# EAGLE design RotaryEncoder (EAGLE 7.1.0)
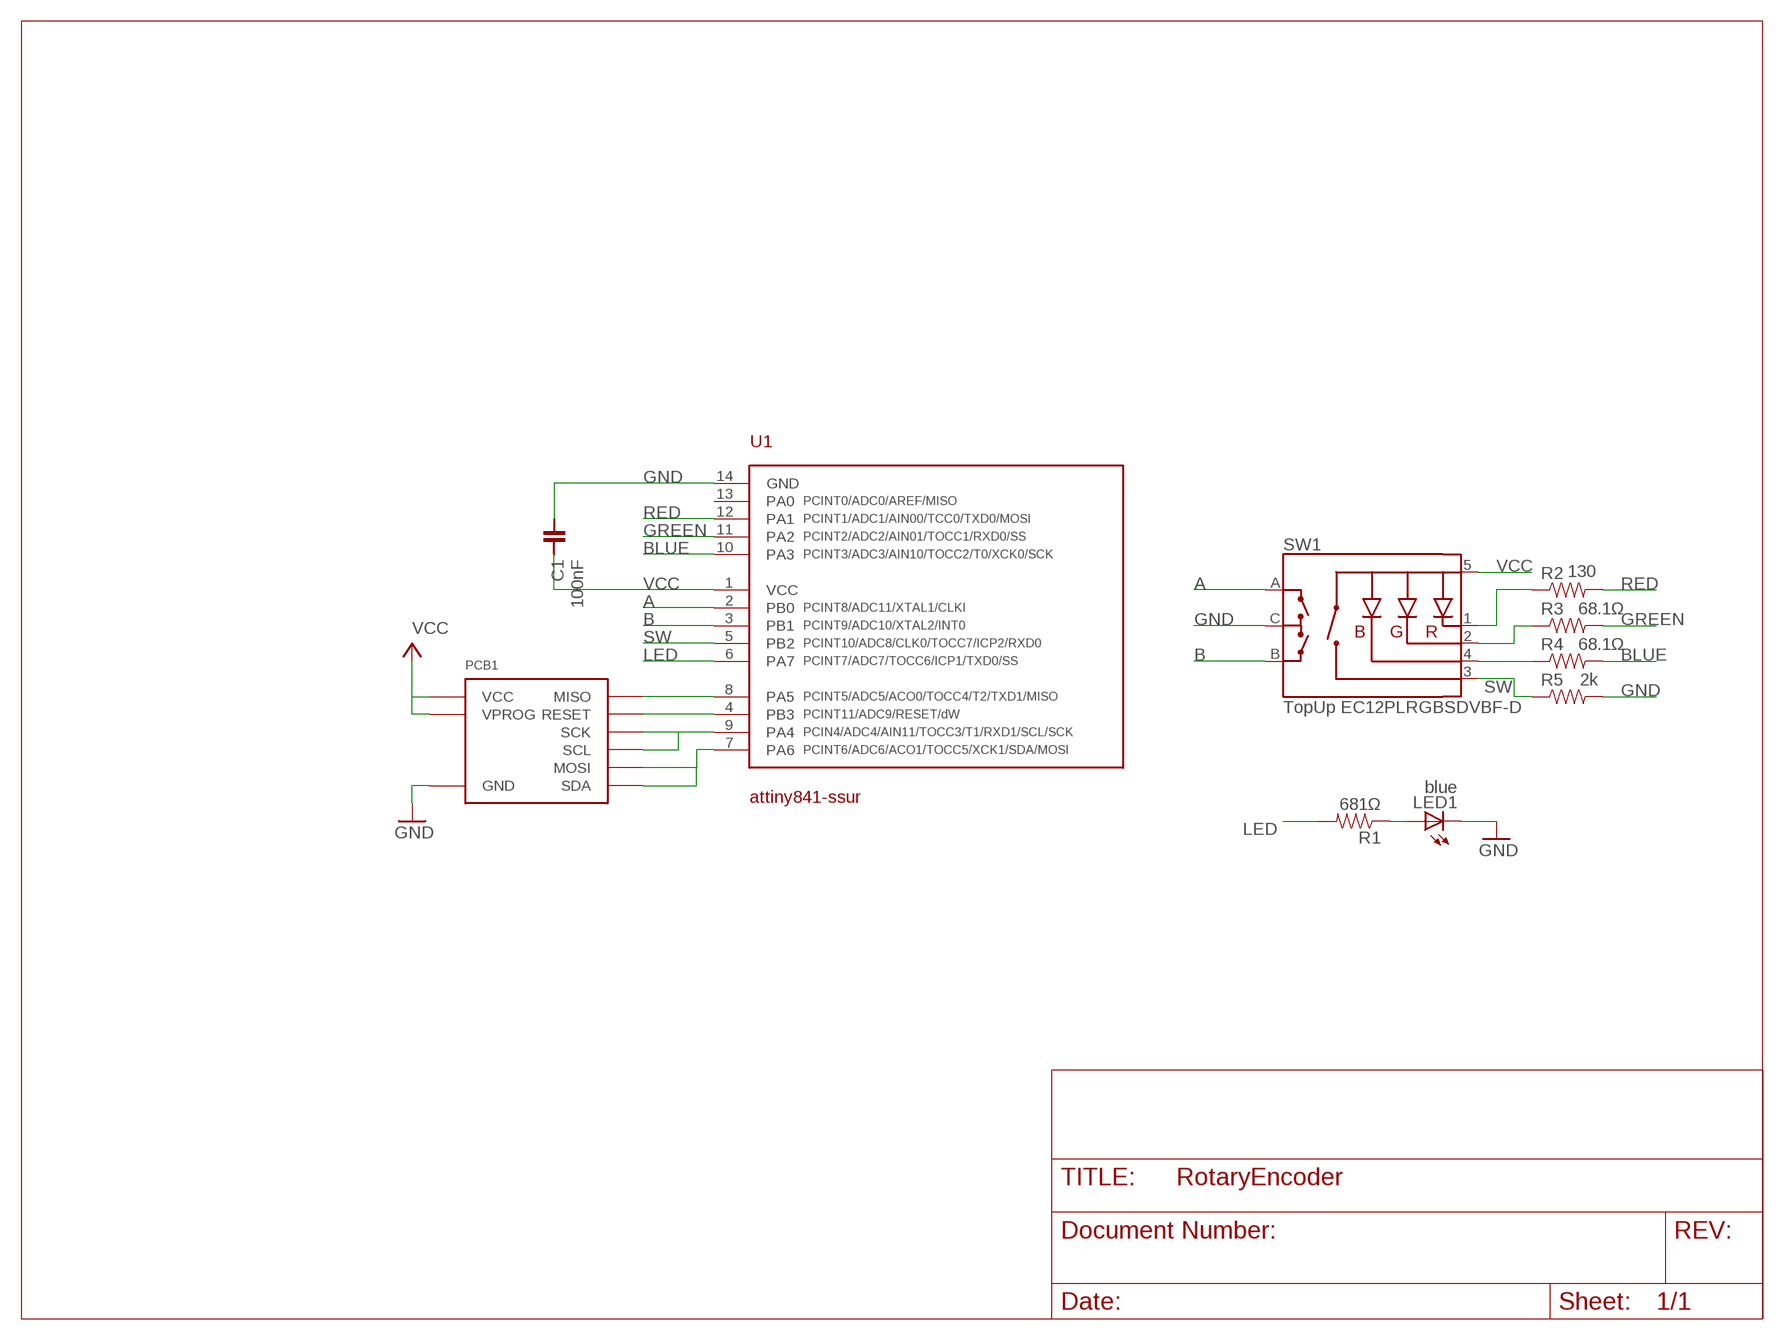
[diagram p0: schematic, sheet 1]

## Parts
C1  100nF  CAPACITOR-100NF  [0603]
LED1  blue  LED-0805-BLUE  [0805-LED]
PCB1  DEVICE-PCB-TABS  [DEVICE-PCB-TABS]
R1  681Ω  RESISTOR-681Ω  [0603]
R2  130  RESISTOR-0603  [0603]
R3  68.1Ω  RESISTOR-68.1Ω  [0603]
R4  68.1Ω  RESISTOR-68.1Ω  [0603]
R5  2k  RESISTOR-0603  [0603]
SW1  TopUp EC12PLRGBSDVBF-D  ENCODER_RGB_CA  [ENCODER_LED_3]
U1  attiny841-ssur  ATTINY841  [SOIC14]

## Nets
A: SW1.A U1.2(PB0)
B: SW1.B U1.3(PB1)
BLUE: R4.2 U1.10(PA3)
GND: C1.2 LED1.C PCB1.BUS0(GND) R5.2 SW1.C U1.14(GND)
GREEN: R3.2 U1.11(PA2)
LED: R1.2 U1.6(PA7)
MISO: PCB1.PROG3(MISO) U1.8(PA5)
N$4: R2.1 SW1.1(-R)
N$5: R3.1 SW1.2(-G)
N$6: R4.1 SW1.4(-B)
N$7: LED1.A R1.1
RED: R2.2 U1.12(PA1)
RESET: PCB1.PROG1(RESET) U1.4(PB3)
SCL/SCK: PCB1.BUS3(SCL) PCB1.PROG2(SCK) U1.9(PA4)
SDA/MOSI: PCB1.BUS1(SDA) PCB1.PROG4(MOSI) U1.7(PA6)
SW: R5.1 SW1.3(SW) U1.5(PB2)
VCC: C1.1 PCB1.BUS2(VCC) PCB1.PROG0(VPROG) SW1.5(+) U1.1(VCC)
Unconnected: U1.13(PA0)

## Library data of the parts
C1 = Modulo:CAPACITOR: Capacitor; PARTNUM: C0603C104K5RACTU
LED1 = Modulo:LED: LED; PARTNUM: LTST-C171TBKT
PCB1 = Modulo:DEVICE-PCB: Modulo Footprint; NOBOM: 1
R1 = Modulo:RESISTOR: Resistor Basic schematic elements and footprints for 0603, 1206, and PTH resistors.; PARTNUM: ERJ-3EKF6810V
R2 R5 = Modulo:RESISTOR: Resistor Basic schematic elements and footprints for 0603, 1206, and PTH resistors.
R3 R4 = Modulo:RESISTOR: Resistor Basic schematic elements and footprints for 0603, 1206, and PTH resistors.; PARTNUM: ERJ-3EKF68R1V
SW1 = SparkFun-Electromechanical:ENCODER_RGB_CA: Illuminated Rotary Encoder w/ RGB LED and select switch EC12PLRGBSDVBF-D: http://top-up.so-buy.com/front/bin/ptdetail.phtml?Part=EC12PLRGBSDVBF-D
U1 = IntegerLabs:ATTINY841

## Board
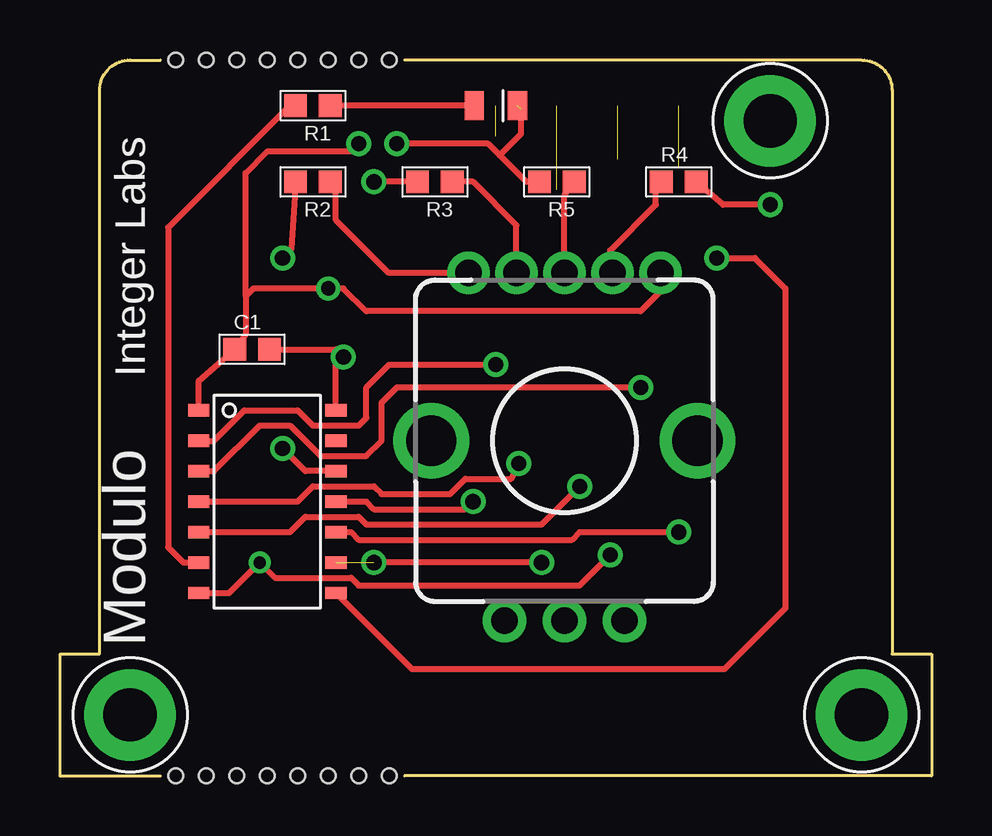
[diagram p1: board, top side]
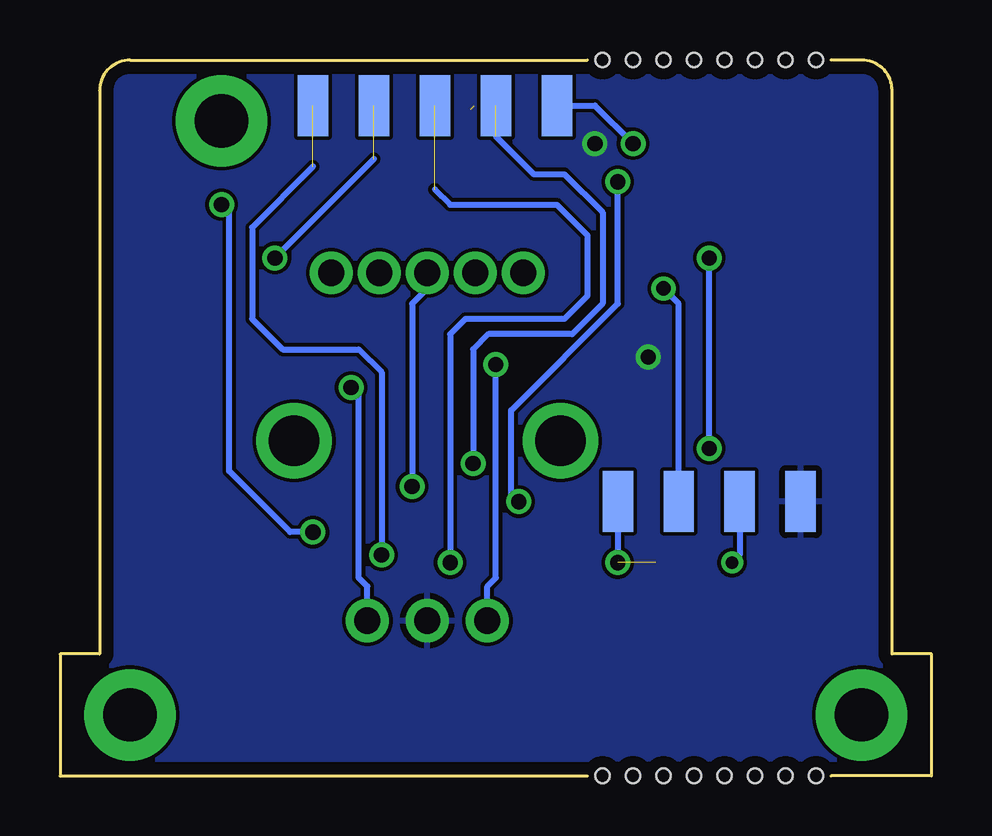
[diagram p2: board, bottom side, seen from below]

Size 36.32 x 29.84 mm. Coordinates in mm from the lower left corner, seen from the top.
Copper layers (1*16): Top 0.0178mm / dielectric 59mil / Bottom 0.0178mm
Design rules "SSC-EAGLE-2Lyr_v1.0.0.3 *": minimum track width 6mil, minimum drill 14mil, track to track 6mil, track to pad 6mil, pad to pad 6mil, via to via 6mil, smd to smd 6mil, copper to edge 20mil, drill to drill 16mil, minimum pad ring 8mil, minimum via ring 8mil, stop-mask expansion 3mil, vias tented up to drill 25mil, thermal gap 10mil

### Footprints (pad centres in the part's own frame; a part is rotated, then mirrored left to right if it is on the bottom)
0603 = smd 0.95 x 0.95: 1 -0.725,0; 2 0.725,0
0805-LED = smd 1.2 x 0.8: A 0,-0.9; C 0,0.9
DEVICE-PCB-TABS = smd 1.27 x 2.54 bottom: BUS0 5.08,11.43; BUS1 7.62,11.43; BUS2 10.16,11.43; BUS3 12.7,11.43; PROG0 15.24,27.94; PROG1 17.78,27.94; PROG2 20.32,27.94; PROG3 22.86,27.94; PROG4 25.4,27.94 | drill 2.223 pad 3.81: P$1 2.54,2.54; P$2 33.02,2.54; P$3 29.21,27.305 | hole 0.6: 4.445,29.845; 5.715,29.845; 6.985,29.845; 8.255,29.845; 9.525,29.845; 10.795,29.845; 12.065,29.845; 13.335,29.845; 4.445,0; 5.715,0; 6.985,0; 8.255,0; 9.525,0; 10.795,0; 12.065,0; 13.335,0
ENCODER_LED_3 = drill 1.1 pad 1.778: 1 -4,7; 2 -2,7; 3 0,7; 4 2,7; 5 4,7 | drill 1.1 pad 1.8: A -2.5,-7.5; B 2.5,-7.5; C 0,-7.5 | drill 2.1: M1 -5.55,0; M2 5.55,0
SOIC14 = smd 0.508 x 0.889: 1 0,-3.175; 2 1.27,-3.175; 3 2.54,-3.175; 4 3.81,-3.175; 5 5.08,-3.175; 6 6.35,-3.175; 7 7.62,-3.175; 8 7.62,2.54; 9 6.35,2.54; 10 5.08,2.54; 11 3.81,2.54; 12 2.54,2.54; 13 1.27,2.54; 14 0,2.54

### Placement (x,y rotation side)
C1  8,17.78 0 top
LED1  18.16,27.94 270 top
PCB1  0.38,0 0 top
R1  10.54,27.94 180 top
R2  10.54,24.77 180 top
R3  15.62,24.77 180 top
R4  25.78,24.77 0 top
R5  20.7,24.77 180 top
SW1  21.02,13.97 0 top
U1  8.95,15.24 270 top

### Tracks (layer width: path | path; a pad name or v marks a point on that pad's centre or on a via)
A  (via drill 0.64)
  Top 0.254: U1.2 6.41,13.97 7.68,15.24 9.91,15.24 10.54,14.61 12.45,14.61 12.76,14.92 12.76,16.19 13.72,17.14 v18.16,17.14
  Bottom 0.254: SW1.A 18.52,7.9 18.16,8.26 v18.16,17.14
B  (via drill 0.64)
  Top 0.254: U1.3 6.41,12.7 8.32,14.61 9.59,14.61 10.86,13.34 12.76,13.34 13.4,13.97 13.4,15.56 14.03,16.19 v24.19,16.19
  Bottom 0.254: SW1.B 23.52,7.9 23.88,8.26 23.88,15.88 v24.19,16.19
BLUE  (via drill 0.64)
  Top 0.254: U1.10 12.13,10.16 12.45,9.84 21.34,9.84 21.65,10.16 v25.78,10.16 | v29.59,23.81 27.63,23.81 R4.2
  Bottom 0.254: v25.78,10.16 26.73,10.16 29.27,12.7 29.27,23.5 v29.59,23.81
GND  (via drill 0.64)  (1 unrouted)
  Top 0.254: U1.14 11.49,17.14 v11.81,17.46 | R5.2 19.43,24.77 18.32,25.88 | 18.32,25.88 17.84,26.35 v14.03,26.35 | 18.32,25.88 19.21,26.77 19.21,27.79 | 11.81,17.78 v11.81,17.46 | C1.2 11.49,17.78 v11.81,17.46
  pour Bottom: 0.38,0 0.38,30.48 35.94,30.48 35.94,0
GREEN  (via drill 0.64)
  Top 0.254: U1.11 12.76,11.43 13.08,11.11 16.89,11.11 v17.21,11.43 | R3.2 v13.08,24.77
  Bottom 0.254: v17.21,11.43 17.53,11.75 17.53,15.24 13.08,19.68 v13.08,24.77
LED
  Top 0.254: R1.2 9.64,27.99 4.51,22.86 4.51,9.53 5.14,8.89 U1.6
MISO  (via drill 0.64)  (1 unrouted)
  Top 0.254: v27.37,21.59 28.96,21.59 30.23,20.32 30.23,6.99 27.69,4.45 14.67,4.45 U1.8
  Bottom 0.254: 23.24,25.72 v27.37,21.59
N$4
  Top 0.254: SW1.1 13.7,20.97 11.49,23.18 11.49,24.71 R2.1
N$5
  Top 0.254: SW1.2 19.02,22.95 17.21,24.77 R3.1
N$6
  Top 0.254: SW1.4 22.92,21.07 22.92,21.91 24.83,23.81 24.83,24.71 R4.1
N$7
  Top 0.254: LED1.A R1.1
RED  (via drill 0.64)
  Top 0.254: U1.12 10.22,12.7 v9.27,13.65 | R2.2 9.64,21.96 v9.27,21.59
  Bottom 0.254: v9.27,13.65 v9.27,21.59
RESET  (via drill 0.64)  (1 unrouted)
  Top 0.254: U1.4 9.91,11.43 10.54,12.06 13.08,12.06 13.4,11.75 16.26,11.75 16.89,12.38 18.8,12.38 v19.11,13.02
  Bottom 0.254: 18.16,26.67 16.57,25.08 15.3,25.08 13.72,23.5 13.72,19.68 14.99,18.41 18.48,18.41 19.11,17.78 v19.11,13.02
SCL/SCK  (via drill 0.64)  (2 unrouted)
  Top 0.254: v20.07,8.89 v13.08,8.89
  Bottom 0.254: PCB1.BUS3 v13.08,8.89 | 20.7,24.45 20.07,23.81 15.62,23.81 14.35,22.54 14.35,20 15.3,19.05 19.43,19.05 20.07,18.41 v20.07,8.89
SDA/MOSI  (via drill 0.51, 0.64)  (1 unrouted)
  Top 0.254: v22.92,9.21 21.65,7.94 12.45,7.94 12.13,8.26 8.95,8.26 v8.32,8.89 7.05,7.62 U1.7
  Bottom 0.254: 25.78,25.4 28.32,22.86 28.32,19.05 27.05,17.78 23.88,17.78 22.92,16.83 v22.92,9.21 | PCB1.BUS1 8,9.21 v8.32,8.89
SW  (via drill 0.64)
  Top 0.254: SW1.3 21.02,24.18 R5.1 | U1.5 9.59,10.16 10.22,10.79 12.45,10.79 12.76,10.48 20.07,10.48 v21.65,12.06
  Bottom 0.254: SW1.3 21.02,20.32 21.65,19.68 v21.65,12.06
VCC  (via drill 0.6, 0.64)
  Top 0.254: 7.74,20 7.74,25.14 8.64,26.04 12.13,26.04 v12.45,26.35 | SW1.5 25.02,20.19 24.19,19.37 12.76,19.37 11.81,20.32 v11.18,20.32 8.05,20.32 7.74,20 | 7.74,20 7.74,18.41 C1.1 5.78,16.46 U1.1
  Bottom 0.254: PCB1.PROG0 14.03,27.94 v12.45,26.35 | PCB1.BUS2 10.54,19.68 v11.18,20.32